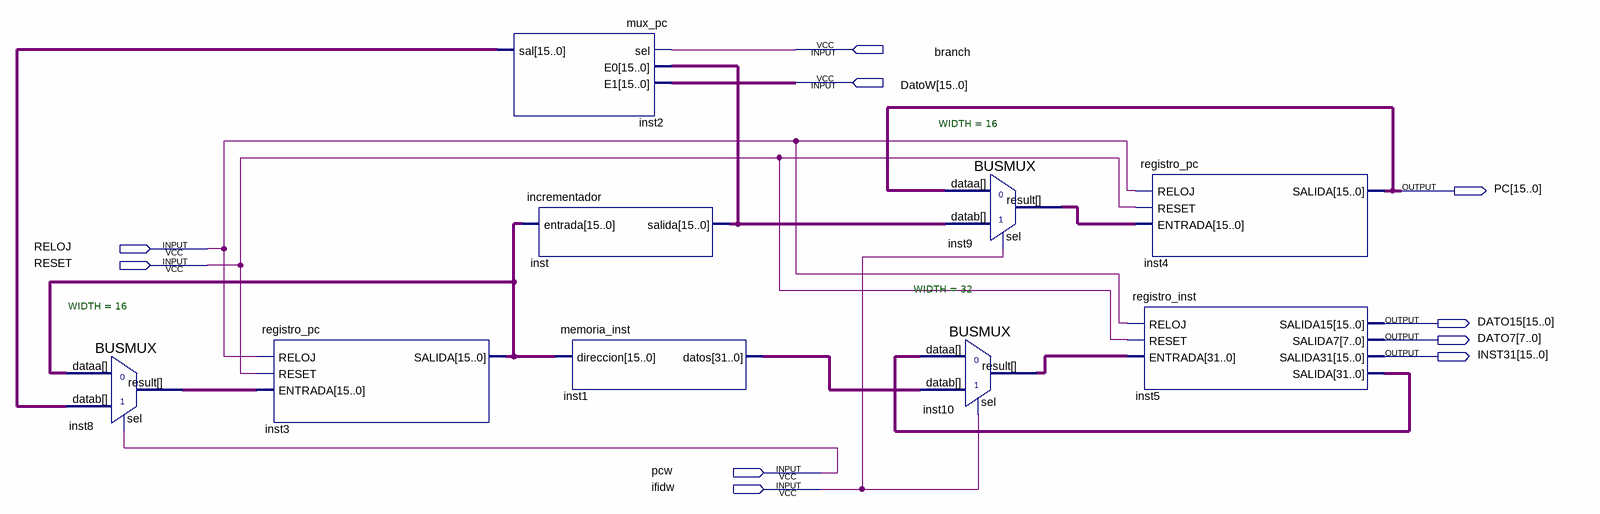
[diagram p0: schematic sheet]
// Quartus schematic etapa1.bdf as structural Verilog: 9 symbols, 10 pins
module etapa1 (
  input  branch,
  input  [15:0] DatoW,
  input  RELOJ,
  input  RESET,
  input  pcw,
  input  ifidw,
  output [15:0] PC,
  output [15:0] DATO15,
  output [7:0] DATO7,
  output [15:0] INST31
);

  wire [15:0] inst2_sal, inst3_salida, inst8_result, inst9_result, inst_salida;
  wire [31:0] inst1_datos, inst5_salida, inst10_result;

  BUSMUX #(.WIDTH(16)) inst8 (.datab(inst2_sal), .sel(pcw), .dataa(inst3_salida), .result(inst8_result));
  registro_pc inst3 (.RELOJ(RELOJ), .RESET(RESET), .ENTRADA(inst8_result), .SALIDA(inst3_salida));
  mux_pc inst2 (.sel(branch), .E0(inst_salida), .E1(DatoW), .sal(inst2_sal));
  incrementador inst (.entrada(inst3_salida), .salida(inst_salida));
  memoria_inst inst1 (.direccion(inst3_salida), .datos(inst1_datos));
  BUSMUX #(.WIDTH(16)) inst9 (.datab(inst_salida), .sel(ifidw), .dataa(PC), .result(inst9_result));
  BUSMUX #(.WIDTH(32)) inst10 (.datab(inst1_datos), .sel(ifidw), .dataa(inst5_salida), .result(inst10_result));
  registro_pc inst4 (.RELOJ(RELOJ), .RESET(RESET), .ENTRADA(inst9_result), .SALIDA(PC));
  registro_inst inst5 (
    .RELOJ(RELOJ), .RESET(RESET), .ENTRADA(inst10_result), .SALIDA15(DATO15), .SALIDA7(DATO7),
    .SALIDA31(INST31), .SALIDA(inst5_salida));
endmodule
